# EAGLE design OSO-TIBO-B1-00 (EAGLE 9.6.2)

## Sheet 1 of 2
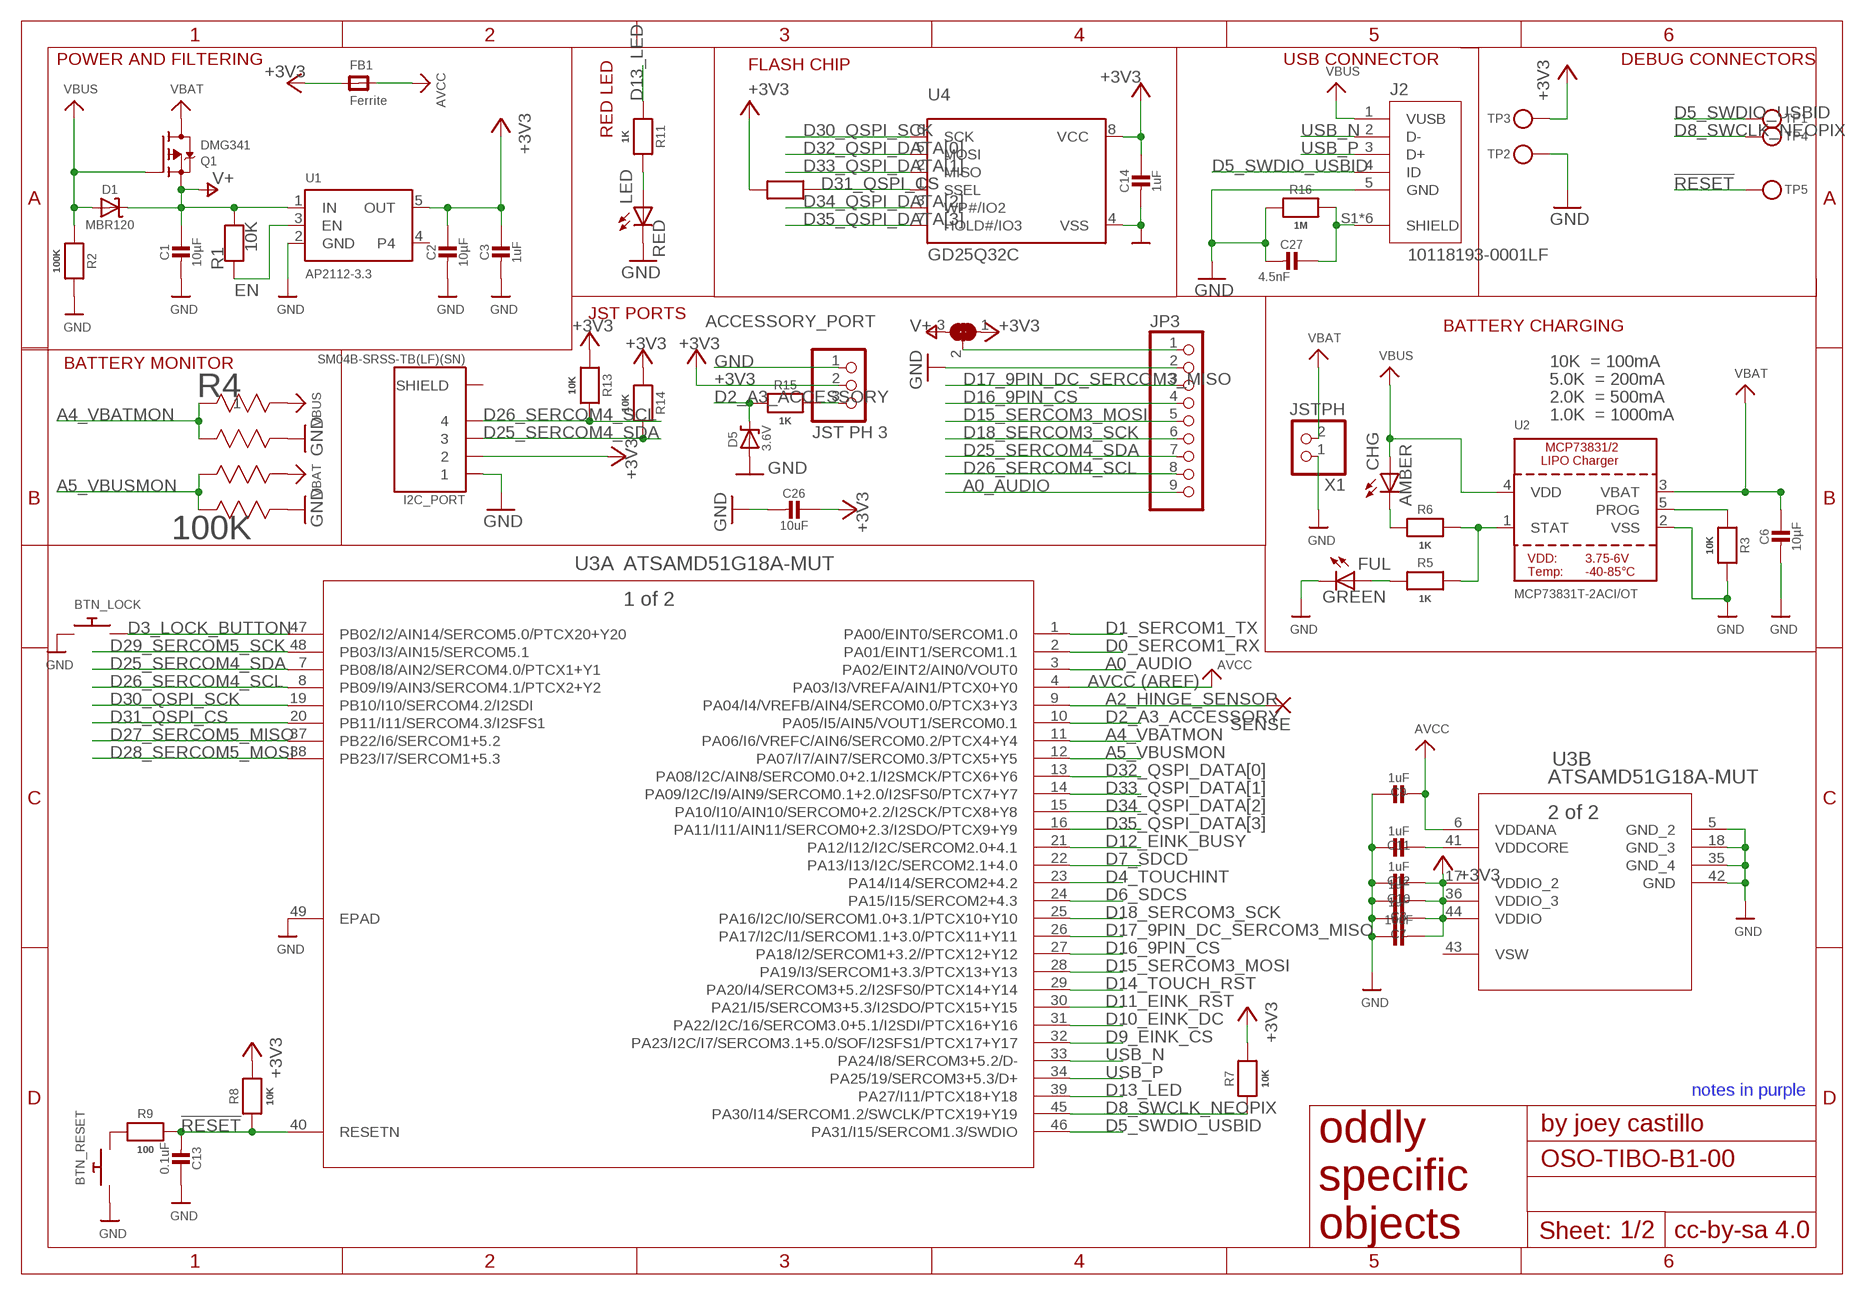
[diagram p0: schematic, sheet 1]

### Parts
ACCESSORY_PORT  JST PH 3  CON_JST_PH_3PIN  [JSTPH3]
BTN_LOCK  SWITCH_PUSHBUTTONC&K_KSS  [BTN_CK_KSS]
BTN_RESET  SWITCH_PUSHBUTTONC&K_KSS  [BTN_CK_KSS]
C1  10µF  CAP_CERAMIC0805-NOOUTLINE  [0805-NO]
C2  10µF  CAP_CERAMIC0805-NOOUTLINE  [0805-NO]
C3  1uF  CAP_CERAMIC0805-NOOUTLINE  [0805-NO]
C6  10µF  CAP_CERAMIC0805-NOOUTLINE  [0805-NO]
C7  10uF  CAP_CERAMIC0805-NOOUTLINE  [0805-NO]
C8  1uF  CAP_CERAMIC0805-NOOUTLINE  [0805-NO]
C9  1uF  CAP_CERAMIC0805-NOOUTLINE  [0805-NO]
C10  1uF  CAP_CERAMIC0805_10MGAP  [0805_10MGAP]
C11  1uF  CAP_CERAMIC0805_10MGAP  [0805_10MGAP]
C12  1uF  CAP_CERAMIC0805_10MGAP  [0805_10MGAP]
C13  0.1uF  CAP_CERAMIC0805_10MGAP  [0805_10MGAP]
C14  1uF  CAP_CERAMIC0805_10MGAP  [0805_10MGAP]
C26  10uF  CAP_CERAMIC0805-NOOUTLINE  [0805-NO]
C27  4.5nF  CAP_CERAMIC0805-NOOUTLINE  [0805-NO]
CHG  AMBER  LEDCHIPLED_0805  [CHIPLED_0805]
D1  MBR120  DIODE-SCHOTTKYSOD-123  [SOD-123]
D5  3.6V  DIODE-ZENERSOD123  [SOD-123]
FB1  Ferrite  FERRITE0805  [0805]
FUL  GREEN  LEDCHIPLED_0805  [CHIPLED_0805]
I2C_PORT  SM04B-SRSS-TB(LF)(SN)  [JST_SM04B-SRSS-TB(LF)(SN)]
J2  10118193-0001LF  [FCI_10118193-0001LF]
JP3  HEADER-1X9_JSTSH  [JST_SH9]
LED  RED  LEDCHIPLED_0805  [CHIPLED_0805]
Q1  DMG341  MOSFET-P  [SOT23-R]
R1  10K  RESISTOR0805_NOOUTLINE  [0805-NO]
R2  100K  RESISTOR0805_NOOUTLINE  [0805-NO]
R3  10K  RESISTOR0805_NOOUTLINE  [0805-NO]
R4  100K  EXB-V8V103JV  [EXBV8V]
R5  1K  RESISTOR0805_NOOUTLINE  [0805-NO]
R6  1K  RESISTOR0805_NOOUTLINE  [0805-NO]
R7  10K  RESISTOR0805_NOOUTLINE  [0805-NO]
R8  10K  RESISTOR0805_NOOUTLINE  [0805-NO]
R9  100  RESISTOR0805_10MGAP  [0805_10MGAP]
R10  10K  RESISTOR0805_NOOUTLINE  [0805-NO]
R11  1K  RESISTOR0805_NOOUTLINE  [0805-NO]
R13  10K  RESISTOR0805_NOOUTLINE  [0805-NO]
R14  10K  RESISTOR0805_NOOUTLINE  [0805-NO]
R15  1K  RESISTOR_0805MP  [_0805MP]
R16  1M  RESISTOR0805_NOOUTLINE  [0805-NO]
SENSE  SMD5  [SMD2,54-5,08]
SJ1  SOLDERJUMPER_2WAY  [SOLDERJUMPER_2WAY_OPEN_NOPASTE]
TP1  TESTPOINTROUND2MMNO  [TESTPOINT_ROUND_2MM_NO]
TP2  TESTPOINTROUND2MMNO  [TESTPOINT_ROUND_2MM_NO]
TP3  TESTPOINTROUND2MMNO  [TESTPOINT_ROUND_2MM_NO]
TP4  TESTPOINTROUND2MMNO  [TESTPOINT_ROUND_2MM_NO]
TP5  TESTPOINTROUND2MMNO  [TESTPOINT_ROUND_2MM_NO]
U1  AP2112-3.3  VREG_SOT23-5  [SOT23-5]
U2  MCP73831T-2ACI/OT  MCP73831/2  [SOT23-5]
U3  ATSAMD51G18A-MUT  [QFN48_7X7MC]
U4  GD25Q32C  MICROBUILDER_SPIFLASH_SOIC8  [MICROBUILDER_SOIC8_150MIL]
X1  JSTPH  CON_JST_PH_2PIN  [JSTPH2]

### Nets
!RESET: C13.2 R8.1 R9.2 TP5.P$1 U3.40(A:RESETN)
+3V3 [power]: ACCESSORY_PORT.2 C2.1 C3.1 C7.2 C8.2 C10.2 C12.2 C14.1 C26.1 FB1.1 I2C_PORT.2 R7.2 R8.2 R10.2 R13.1 R14.1 SJ1.1 TP3.P$1 U1.5(OUT) U3.17(B:VDDIO_2) U3.36(B:VDDIO_3) U3.44(B:VDDIO) U4.8(VCC) ; also sheet 2
_ACCESSORY: ACCESSORY_PORT.3 R15.1
A0_AUDIO: JP3.9 U3.3(A:PA02/EINT2/AIN0/VOUT0)
A2_HINGE_SENSOR: SENSE.1(P) U3.9(A:PA04/I4/VREFB/AIN4/SERCOM0.0/PTCX3+Y3)
A4_VBATMON: R4.1 R4.2 U3.11(A:PA06/I6/VREFC/AIN6/SERCOM0.2/PTCX4+Y4)
A5_VBUSMON: R4.3 R4.4 U3.12(A:PA07/I7/AIN7/SERCOM0.3/PTCX5+Y5)
AVCC: C9.2 FB1.2 U3.4(A:PA03/I3/VREFA/AIN1/PTCX0+Y0) U3.6(B:VDDANA)
D0_SERCOM1_RX: U3.2(A:PA01/EINT1/SERCOM1.1) ; also sheet 2
D1_SERCOM1_TX: U3.1(A:PA00/EINT0/SERCOM1.0) ; also sheet 2
D2_A3_ACCESSORY: D5.C R15.2 U3.10(A:PA05/I5/AIN5/VOUT1/SERCOM0.1)
D3_LOCK_BUTTON: BTN_LOCK.P$2 U3.47(A:PB02/I2/AIN14/SERCOM5.0/PTCX20+Y20)
D4_TOUCHINT: U3.23(A:PA14/I14/SERCOM2+4.2) ; also sheet 2
D5_SWDIO_USBID: J2.4(ID) TP1.P$1 U3.46(A:PA31/I15/SERCOM1.3/SWDIO)
D6_SDCS: U3.24(A:PA15/I15/SERCOM2+4.3) ; also sheet 2
D7_SDCD: U3.22(A:PA13/I13/I2C/SERCOM2.1+4.0) ; also sheet 2
D8_SWCLK_NEOPIX: R7.1 TP4.P$1 U3.45(A:PA30/I14/SERCOM1.2/SWCLK/PTCX19+Y19) ; also sheet 2
D9_EINK_CS: U3.32(A:PA23/I2C/I7/SERCOM3.1+5.0/SOF/I2SFS1/PTCX17+Y17) ; also sheet 2
D10_EINK_DC: U3.31(A:PA22/I2C/16/SERCOM3.0+5.1/I2SDI/PTCX16+Y16) ; also sheet 2
D11_EINK_RST: U3.30(A:PA21/I5/SERCOM3+5.3/I2SDO/PTCX15+Y15) ; also sheet 2
D12_EINK_BUSY: U3.21(A:PA12/I12/I2C/SERCOM2.0+4.1) ; also sheet 2
D13_LED: R11.1 U3.39(A:PA27/I11/PTCX18+Y18)
D14_TOUCH_RST: U3.29(A:PA20/I4/SERCOM3+5.2/I2SFS0/PTCX14+Y14) ; also sheet 2
D15_SERCOM3_MOSI: JP3.5 U3.28(A:PA19/I3/SERCOM1+3.3/PTCX13+Y13) ; also sheet 2
D16_9PIN_CS: JP3.4 U3.27(A:PA18/I2/SERCOM1+3.2//PTCX12+Y12)
D17_9PIN_DC_SERCOM3_MISO: JP3.3 U3.26(A:PA17/I2C/I1/SERCOM1.1+3.0/PTCX11+Y11)
D18_SERCOM3_SCK: JP3.6 U3.25(A:PA16/I2C/I0/SERCOM1.0+3.1/PTCX10+Y10) ; also sheet 2
D25_SERCOM4_SDA: I2C_PORT.3 JP3.7 R14.2 U3.7(A:PB08/I8/AIN2/SERCOM4.0/PTCX1+Y1) ; also sheet 2
D26_SERCOM4_SCL: I2C_PORT.4 JP3.8 R13.2 U3.8(A:PB09/I9/AIN3/SERCOM4.1/PTCX2+Y2) ; also sheet 2
D27_SERCOM5_MISO: U3.37(A:PB22/I6/SERCOM1+5.2) ; also sheet 2
D28_SERCOM5_MOSI: U3.38(A:PB23/I7/SERCOM1+5.3) ; also sheet 2
D29_SERCOM5_SCK: U3.48(A:PB03/I3/AIN15/SERCOM5.1) ; also sheet 2
D30_QSPI_SCK: U3.19(A:PB10/I10/SERCOM4.2/I2SDI) U4.6(SCK)
D31_QSPI_CS: R10.1 U3.20(A:PB11/I11/SERCOM4.3/I2SFS1) U4.1(SSEL)
D32_QSPI_DATA[0]: U3.13(A:PA08/I2C/AIN8/SERCOM0.0+2.1/I2SMCK/PTCX6+Y6) U4.5(MOSI)
D33_QSPI_DATA[1]: U3.14(A:PA09/I2C/I9/AIN9/SERCOM0.1+2.0/I2SFS0/PTCX7+Y7) U4.2(MISO)
D34_QSPI_DATA[2]: U3.15(A:PA10/I10/AIN10/SERCOM0+2.2/I2SCK/PTCX8+Y8) U4.3(WP#/IO2)
D35_QSPI_DATA[3]: U3.16(A:PA11/I11/AIN11/SERCOM0+2.3/I2SDO/PTCX9+Y9) U4.7(HOLD#/IO3)
EN: R1.1 U1.3(EN) ; also sheet 2
GND [gnd]: ACCESSORY_PORT.1 BTN_LOCK.P$1 BTN_RESET.P$1 C1.2 C2.2 C3.2 C6.2 C7.1 C8.1 C9.1 C10.1 C11.1 C12.1 C13.1 C14.2 C26.2 C27.2 D5.A FUL.C I2C_PORT.1 J2.5(GND) JP3.2 LED.C R2.2 R3.2 R4.5 R4.7 R16.2 TP2.P$1 U1.2(GND) U2.2(VSS) U3.5(B:GND_2) U3.18(B:GND_3) U3.35(B:GND_4) U3.42(B:GND) U3.49(A:EPAD) U4.4(VSS) X1.1 ; also sheet 2
N$1: BTN_RESET.P$2 R9.1
N$4: CHG.C R6.1
N$5 [power]: JP3.1 SJ1.2
N$7: LED.A R11.2
N$9: FUL.A R5.1
PROG: R3.1 U2.5(PROG)
SHIELD [gnd]: C27.1 J2.S1(SHIELD) J2.S2(SHIELD) J2.S3(SHIELD) J2.S4(SHIELD) J2.S5(SHIELD) J2.S6(SHIELD) R16.1
STAT: R5.2 R6.2 U2.1(STAT)
USB_N: J2.2(D-) U3.33(A:PA24/I8/SERCOM3+5.2/D-)
USB_P: J2.3(D+) U3.34(A:PA25/19/SERCOM3+5.3/D+)
V+ [power]: C1.1 D1.C Q1.2(S) R1.2 SJ1.3 U1.1(IN)
VBAT [power]: C6.1 Q1.3(D) R4.6 U2.3(VBAT) X1.2
VBUS [power]: CHG.A D1.A J2.1(VUSB) Q1.1(G) R2.1 R4.8 U2.4(VDD)
VDDCORE: C11.2 U3.41(B:VDDCORE)
Unconnected: I2C_PORT.S1(SHIELD) I2C_PORT.S2(SHIELD) U1.4

### Notes on the sheet
- RED LED
- POWER AND FILTERING | USB CONNECTOR | DEBUG CONNECTORS
- FLASH CHIP
- JST PORTS
- BATTERY CHARGING
- BATTERY MONITOR | 10K  = 100mA
- 5.0K  = 200mA
- 2.0K  = 500mA
- 1.0K  = 1000mA
- (AREF)
- notes in purple

## Sheet 2 of 2
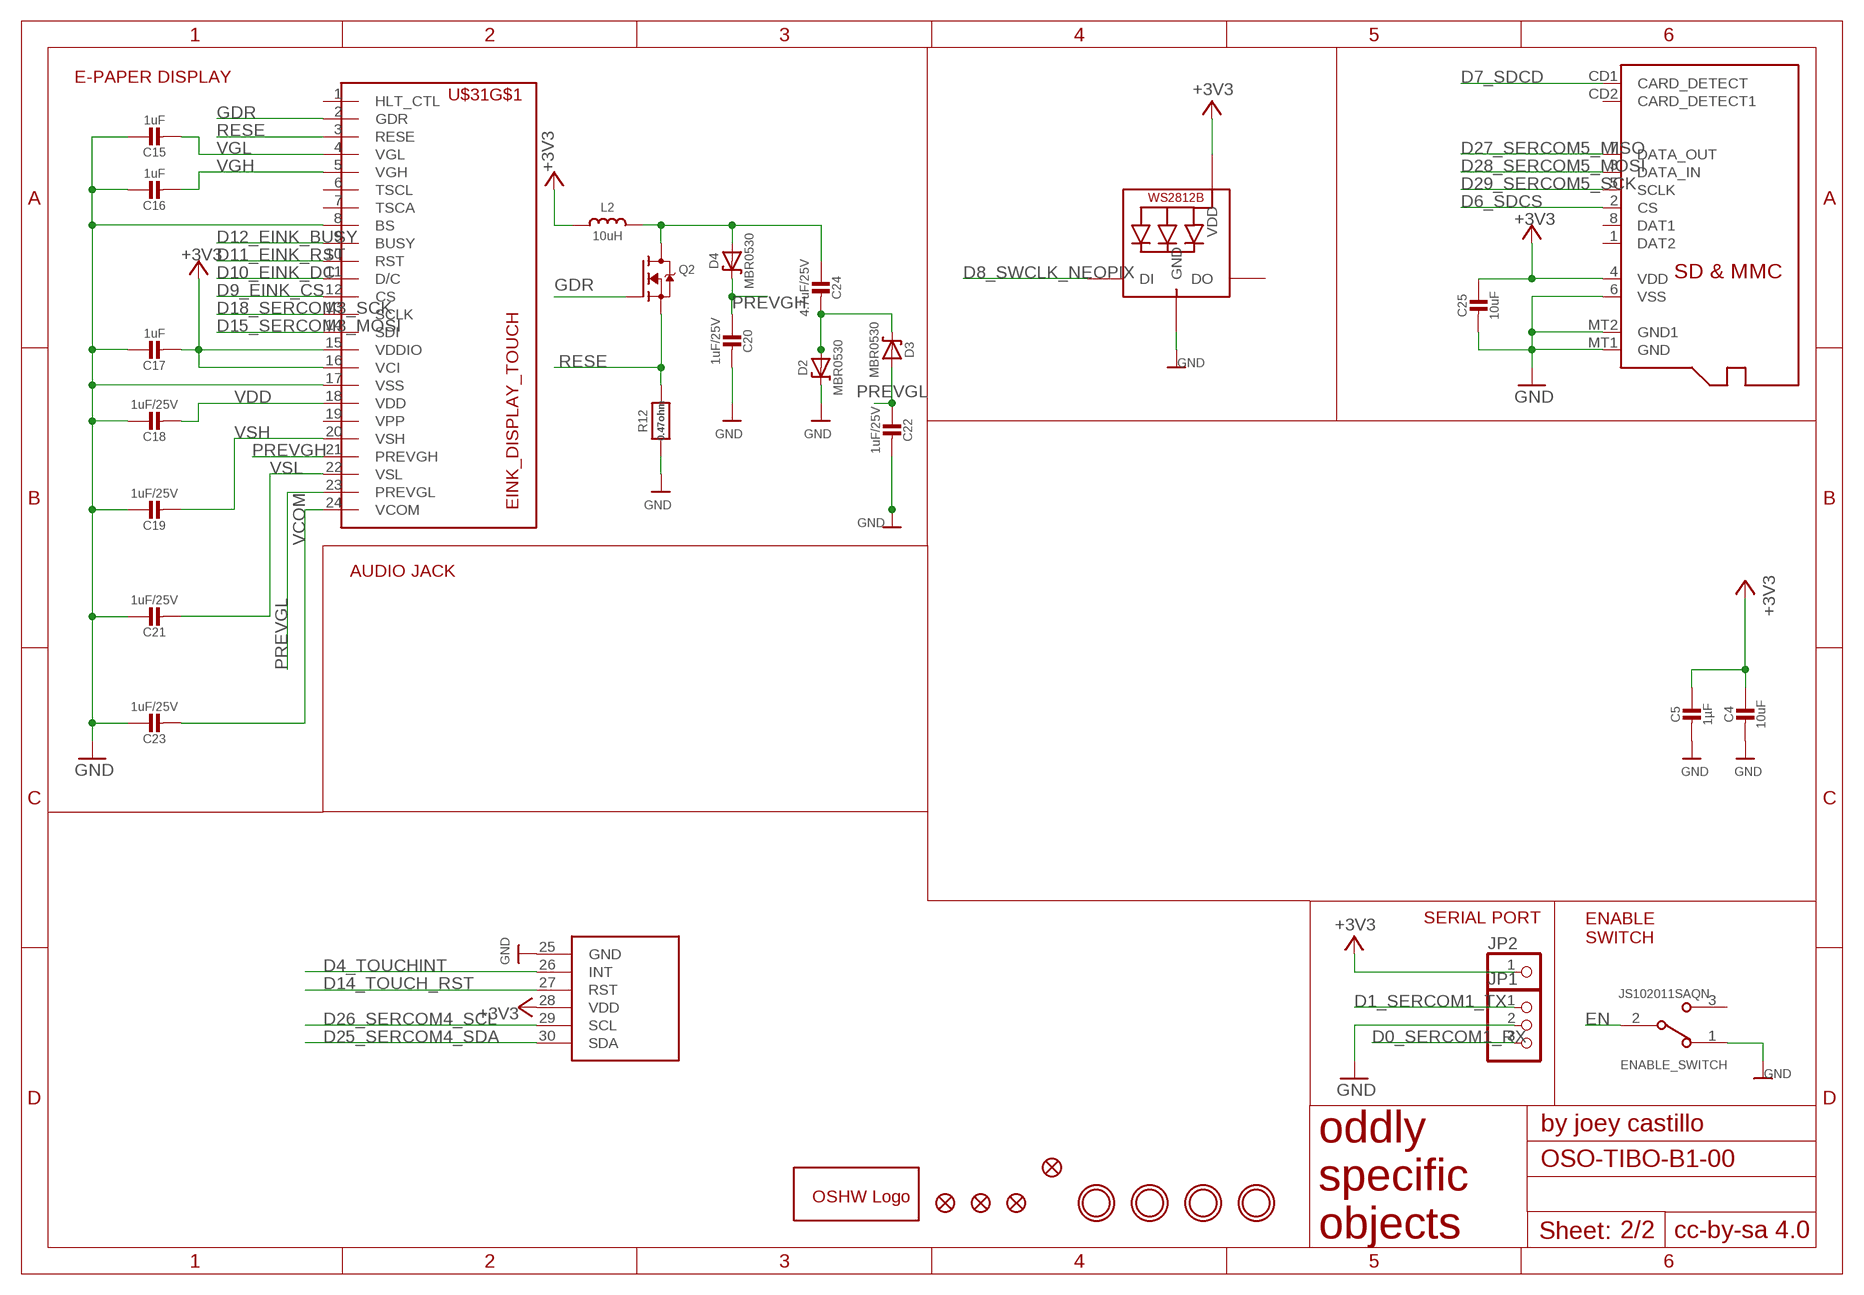
[diagram p1: schematic, sheet 2]

### Parts
C4  10uF  CAP_CERAMIC0805-NOOUTLINE  [0805-NO]
C5  1µF  CAP_CERAMIC0805-NOOUTLINE  [0805-NO]
C15  1uF  CAP_CERAMIC0805_10MGAP  [0805_10MGAP]
C16  1uF  CAP_CERAMIC0805_10MGAP  [0805_10MGAP]
C17  1uF  CAP_CERAMIC0805_10MGAP  [0805_10MGAP]
C18  1uF/25V  CAP_CERAMIC0805_10MGAP  [0805_10MGAP]
C19  1uF/25V  CAP_CERAMIC0805_10MGAP  [0805_10MGAP]
C20  1uF/25V  CAP_CERAMIC0805_10MGAP  [0805_10MGAP]
C21  1uF/25V  CAP_CERAMIC0805_10MGAP  [0805_10MGAP]
C22  1uF/25V  CAP_CERAMIC0805_10MGAP  [0805_10MGAP]
C23  1uF/25V  CAP_CERAMIC0805_10MGAP  [0805_10MGAP]
C24  4.7uF/25V  CAP_CERAMIC0805-NOOUTLINE  [0805-NO]
C25  10uF  CAP_CERAMIC0805_10MGAP  [0805_10MGAP]
D2  MBR0530  DIODE-SCHOTTKYSOD-123  [SOD-123]
D3  MBR0530  DIODE-SCHOTTKYSOD-123  [SOD-123]
D4  MBR0530  DIODE-SCHOTTKYSOD-123  [SOD-123]
ENABLE_SWITCH  JS102011SAQN  [SW_JS102011SAQN]
FID1  FIDUCIAL_1MM  [FIDUCIAL_1MM]
FID2  FIDUCIAL_1MM  [FIDUCIAL_1MM]
FID3  FIDUCIAL_1MM  [FIDUCIAL_1MM]
FID4  FIDUCIAL_1MM  [FIDUCIAL_1MM]
GOLD_ORB_SM1  OSHWLOGOLOGO5MM  [OSHW_5MM]
JP1  PINHD-1X3  [1X03]
JP2  PINHD-1X1  [1X01]
L2  10uH  MICROBUILDER_INDUCTORNR401_BIGPADS  [MICROBUILDER_INDUCTOR_4X4MM_NR401_BIGPADS]
MICROSD  MICROSD  [MICROSD]
NEOPIXEL  WS2812B_4020  [WS2812B_4020]
Q2  IRLML0100  IRLML2060TRPBF  [SOT23-3]
R12  0.47ohm  RESISTOR0805_10MGAP  [0805_10MGAP]
U$1  MOUNTINGHOLE2.5  [MOUNTINGHOLE_2.5_PLATED]
U$4  MOUNTINGHOLE2.5  [MOUNTINGHOLE_2.5_PLATED]
U$5  MOUNTINGHOLE2.5  [MOUNTINGHOLE_2.5_PLATED]
U$7  MOUNTINGHOLE2.5  [MOUNTINGHOLE_2.5_PLATED]
U$31  EINK_DISPLAY_TOUCH  [EINK_DISPLAY_2_7_IN_TOUCH]

### Nets
+3V3 [power]: C4.1 C5.1 C17.2 C25.1 JP2.1 L2.P$1 MICROSD.4(VDD) NEOPIXEL.2(VDD) U$31.15(VDDIO) U$31.16(VCI) U$31.28(VDD) ; also sheet 1
D0_SERCOM1_RX: JP1.3 ; also sheet 1
D1_SERCOM1_TX: JP1.1 ; also sheet 1
D4_TOUCHINT: U$31.26(INT) ; also sheet 1
D6_SDCS: MICROSD.2(CS) ; also sheet 1
D7_SDCD: MICROSD.CD1(CARD_DETECT) ; also sheet 1
D8_SWCLK_NEOPIX: NEOPIXEL.1(DI) ; also sheet 1
D9_EINK_CS: U$31.12(CS) ; also sheet 1
D10_EINK_DC: U$31.11(D/C) ; also sheet 1
D11_EINK_RST: U$31.10(RST) ; also sheet 1
D12_EINK_BUSY: U$31.9(BUSY) ; also sheet 1
D14_TOUCH_RST: U$31.27(RST) ; also sheet 1
D15_SERCOM3_MOSI: U$31.14(SDI) ; also sheet 1
D18_SERCOM3_SCK: U$31.13(SCLK) ; also sheet 1
D25_SERCOM4_SDA: U$31.30(SDA) ; also sheet 1
D26_SERCOM4_SCL: U$31.29(SCL) ; also sheet 1
D27_SERCOM5_MISO: MICROSD.7(DATA_OUT) ; also sheet 1
D28_SERCOM5_MOSI: MICROSD.3(DATA_IN) ; also sheet 1
D29_SERCOM5_SCK: MICROSD.5(SCLK) ; also sheet 1
EN: ENABLE_SWITCH.2 ; also sheet 1
GDR: Q2.1(G) U$31.2(GDR)
GND [gnd]: C4.2 C5.2 C15.1 C16.1 C17.1 C18.1 C19.1 C20.2 C21.1 C22.2 C23.1 C25.2 D2.C ENABLE_SWITCH.1 JP1.2 MICROSD.6(VSS) MICROSD.MT1(GND) MICROSD.MT2(GND1) NEOPIXEL.4(GND) R12.2 U$31.8(BS) U$31.17(VSS) U$31.25(GND) ; also sheet 1
N$2: C24.2 D2.A D3.C
N$3: C24.1 D4.A L2.P$2 Q2.3(D)
PREVGH: C20.1 D4.C U$31.21(PREVGH)
PREVGL: C22.1 D3.A U$31.23(PREVGL)
RESE: Q2.2(S) R12.1 U$31.3(RESE)
VCOM: C23.2 U$31.24(VCOM)
VDD: C18.2 U$31.18(VDD)
VGH: C16.2 U$31.5(VGH)
VGL: C15.2 U$31.4(VGL)
VSH: C19.2 U$31.20(VSH)
VSL: C21.2 U$31.22(VSL)
Unconnected: ENABLE_SWITCH.3 MICROSD.1(DAT2) MICROSD.8(DAT1) MICROSD.CD2(CARD_DETECT1) NEOPIXEL.3(DO) U$31.1(HLT_CTL) U$31.6(TSCL) U$31.7(TSCA) U$31.19(VPP)

### Notes on the sheet
- E-PAPER DISPLAY
- AUDIO JACK
- SERIAL PORT
- ENABLE
  SWITCH

## Power pins joined to a net without a drawn wire
VSW: U3.43(B:VSW)

## Library data of the parts
ACCESSORY_PORT = microbuilder:CON_JST_PH_3PIN
BTN_LOCK BTN_RESET = adafruit:SWITCH_PUSHBUTTON: Buttons SOFTTOUCHSMD_SJ - Soft touch temporary push button (Super Junk Akihabara) Compatible with SKPMANE010 [Mouser: 688-SKPMAN] C&K_KSS = Digikey: KSS221GLFS
C1-C27 = microbuilder:CAP_CERAMIC: Ceramic Capacitors For new designs, use the packages preceded by an '_' character since they are more reliable: The following footprints should be used on most boards: _0402 - Standard footprint for regular board layouts _0603 - Standard footprint for regular board layouts _0805 - Standard footprint for regular board layouts _1206 - Standard footprint for regular board layouts For extremely tight-pitch boards where space is at a premium, the following 'micro-pitch' footprints can be used (smaller pads, no silkscreen outline, etc.): _0402MP - Micro-pitch footprint for very dense/compact boards _0603MP - Micro-pitch footprint for very dense/compact boards _0805MP - Micro-pitch footprint for very dense/compact boards _1206MP - Micro-pitch footprint for very dense/compact boards
CHG FUL LED = adafruit:LED: LED OSRAM: - CHIPLED LG R971, LG N971, LY N971, LG Q971, LY Q971, LO R971, LY R971 LH N974, LH R974 LS Q976, LO Q976, LY Q976 LO Q996 - Hyper CHIPLED LW Q18S LB Q993, LB Q99A, LB R99A - SideLED LS A670, LO A670, LY A670, LG A670, LP A670 LB A673, LV A673, LT A673, LW A673 LH A674 LY A675 LS A676, LA A676, LO A676, LY A676, LW A676 LS A679, LY A679, LG A679 - Hyper Micro SIDELED® LS Y876, LA Y876, LO Y876, LY Y876 LT Y87S - SmartLED LW L88C, LW L88S LB L89C, LB L89S, LG L890 LS L89K, LO L89K, LY L89K LS L896, LA L896, LO L896, LY L896 - TOPLED LS T670, LO T670, LY T670, LG T670, LP T670 LSG T670, LSP T670, LSY T670, LOP T670, LYG T670 LG T671, LOG T671, LSG T671 LB T673, LV T673, LT T673, LW T673 LH T674 LS T676, LA T676, LO T676, LY T676, LB T676, LH T676, LSB T676, LW T676 LB T67C, LV T67C, LT T67C, LS T67K, LO T67K, LY T67K, LW E67C LS E67B, LA E67B, LO E67B, LY E67B, LB E67C, LV E67C, LT E67C LW T67C LS T679, LY T679, LG T679 LS T770, LO T770, LY T770, LG T770, LP T770 LB T773, LV T773, LT T773, LW T773 LH T774 LS E675, LA E675, LY E675, LS T675 LS T776, LA T776, LO T776, LY T776, LB T776 LHGB T686 LT T68C, LB T68C - Hyper Mini TOPLED® LB M676 - Mini TOPLED Santana® LG M470 LS M47K, LO M47K, LY M47K Source: http://www.osram.convergy.de/
D1-D4 = microbuilder:DIODE-SCHOTTKY
D5 = microbuilder:DIODE-ZENER: Zener Diode SMA: 30V 1W Zener Diode, 1.2Vf - Digikey: SMAZ30-FDICT-ND
ENABLE_SWITCH = JS102011SAQN:JS102011SAQN: JS10 Series SPDT On-On 6 V 0.3 A Gull Wing SMT Slide Switch http://www.snapeda.com/parts/JS102011SAQN/C%26K%20Components/view-part/; DESCRIPTION: Slide Switch SPDT Surface Mount, Right Angle; DIGI-KEY_PART_NUMBER: 401-1999-1-ND; DIGI-KEY_PURCHASE_URL: https://www.digikey.com/product-detail/en/c-k/JS102011SAQN/401-1999-1-ND/1640114?utm_source=snapeda&utm_medium=aggregator&utm_campaign=symbol; MF: C&K; MP: JS102011SAQN; PACKAGE: None
FB1 = microbuilder:FERRITE: Ferrite Bead 0603 MMZ1608B121C - 120 Ohm @ 100MHz, 600mA, 0.15 Ohm DC Resistance - Digikey: 445-2164-1-ND BK1608HW121-T - 120 Ohm, 600mA Ferrite Chip - Digikey: 587-1876-2-ND 0805 HZ0805B272R-10 - 2.7K Ohm @ 100MHz, 200mA, 0.8 Ohm DC Resistance - Digikey: 240-2504-1-ND (see also Murata BLM21BD272SN1L) MMZ2012Y152B - 1.5K Ohm @ 100MHz, 500mA, 0.4 Ohm DC Resistance - Digikey: 445-1560-1-ND - Mainly for high frequency (80-400MHz) MMZ2012R102A - 1K Ohm @ 100MHz, 500mA, 0.3 Ohm DC Resistance - Digikey: 445-1555-2-ND - More general purpose (10-200MHz)
FID1-FID4 = microbuilder:FIDUCIAL: Fiducial Alignment Points Various fiducial points for machine vision alignment.; BOM: EXCLUDE
GOLD_ORB_SM1 = oshw:OSHWLOGO: The OSHW logo for PCB layout
I2C_PORT = SM04B-SRSS-TB_LF__SN_:SM04B-SRSS-TB(LF)(SN): SH Series 1.0 mm Pitch 2 Position Single Row Side Entry Shrouded Header; DESCRIPTION: SH Series 1.0 mm Pitch 2 Position Single Row Side Entry Shrouded Header; DIGI-KEY_PART_NUMBER: 455-1804-1-ND; DIGI-KEY_PURCHASE_URL: https://www.digikey.com/product-detail/en/jst-sales-america-inc/SM04B-SRSS-TB_LF__SN_/455-1804-1-ND/926875?utm_source=snapeda&utm_medium=aggregator&utm_campaign=symbol; MF: JST Sales; MP: SM04B-SRSS-TB_LF__SN_; PACKAGE: None
J2 = 10118193-0001LF:10118193-0001LF: Micro USB B Type Receptacle; DESCRIPTION: Single Port 5 Contact Shielded SMT MICRO USB B-Type Receptacle; DIGI-KEY_PART_NUMBER: 609-4616-1-ND; DIGI-KEY_PURCHASE_URL: https://www.digikey.com/product-detail/en/amphenol-icc-fci/10118193-0001LF/609-4616-1-ND/2785380?utm_source=snapeda&utm_medium=aggregator&utm_campaign=symbol; MF: Amphenol ICC; MP: 10118193-0001LF; PACKAGE: None
JP1 = adafruit:PINHD-1X3: PIN HEADER
JP2 = adafruit:PINHD-1X1: Pin header 1x1 for 0.1" spacing With round pins
JP3 = My Stuff:HEADER-1X9: PIN HEADER
L2 = Adafruit 3.5in 480x320 FeatherWing:MICROBUILDER_INDUCTOR: Inductors 0603: 10nH Ceramic Inductor - microwire antenna/RF (Digikey: 712-1434-2-ND) 0805: 560nH Ceramic Inductor - RF (Digikey: 553-1047-1-ND) 270nH Ceramic Inductor - Q = 40@250MHz, +-5%, 1 Ohm DC Resistance (Digikey: 535-10506-2-ND) 1007 (2518 Metric) SMT: 10µH 10% 250mOhm 820mA 1007 Inductor (Digikey: 587-2189-1-ND) 22µH 10% 500mOhm 580mA 1007 Inductor (Digikey: 587-2190-1-ND) 47µH 10% 950mOhm 420mA 1007 Inductor (Digikey: 587-2191-1-ND) 47µH 5% 100mOhm 1A 1008 Inductor (Digikey: 732-1816-1-ND) 5.0x5.0mm (Taiyo Yuden NR5040 Series) 6.8µH 20% 2.3A 64mOhm Inductor (Digikey: 587-2374-2-ND) 5.0x5.0mm (TDK VLC5045 Series) 4.7µH 20% 3.3A 34mOhm Inductor (Digikey: 445-6526-1-ND) 6.8µH 20% 2.7A 46mOhm Inductor (Digikey: 445-6527-1-ND) 6.0x6.0mm (TDK VLC6045 Series) 4.7µH 20% 3.8A 27mOhm Inductor (Digikey: 445-6538-2-ND) 6.8µH 20% 3A 41mOhm Inductor (Digikey: 445-6540-1-ND) 6.2µH 30% 2.2A 45mOhm Inductor (Digikey: SRR5028-6R2YCT-ND) - Not TDK VLC6045 but footprint should match 6.0x6.0mm (TDK SLF6045 Series) 6.8uH 30% 2A 33mOhm Inductor (Digikey: 445-4572-1-ND, Mouser: 810-SLF645T6R8N2R0PF) 6.0x6.0mm (Sumida CDRH5D28 Series) 6.2uH 30% 1.8A 45mOhm Inductor (Digikey: 308-1542-1-ND) Taiyo Yuden NR3015T2R2M - 2.2uH 20% 1.5A (Digikey: 587-1648-2-ND, Mouser: 963-NR3015T2R2M) - Used with TI TPS62172 CoilCraft RFID Transponder Coil - MA5532-AE (For use with AS3935 Lightning Sensor) Taiyo Yuden NRH2412T2R2MNGH - 2.2uH 20% 1AA (Digikey: 587-3443-1-ND) - Used with TI LM3671 Vishay IHLP 1.0uH Molded Inductor - 24mOhm DCR, 5A, +/-20%, -55°C-125°C (Digikey: 541-1319-1-ND)
MICROSD = adafruit:MICROSD: Micro-SD / Transflash card holder with SPI pinout For the 3M # 2908-05WB-MG and/or 4UCON #19656 push-push type
NEOPIXEL = microbuilder:WS2812B
Q1 = microbuilder:MOSFET-P: P-Channel Mosfet LEGEND VDS: Voltage Drain-Source ID: Drain Current RDS(ON): Drain-Source On-State Resistance VGS(TH): Gate-Source Threshold Voltage CISS: Drain-Source Input Capacitance SOT-23 Name VDS ID RDS(ON) VGS(TH) CISS Order Number IRLML5103 30V 760mA 600 mOhm -- 75pF @ 25V Digikey: IRLML5103PBFCT-ND IRLML6401 12V 4.3A 50 mOhm 950mV @ 250µA 830pF @ 10V Digikey: IRLML6401PBFTR-ND NTR0202PL 20V 400mA 800 mOhm 2.3V @ 250uA 70pF @ 5V Digikey: NTR0202PLT1GOSTR-ND NTR4101PT1G 20V 1.8A 85 mOhm 1.2V @ 250uA 675pF @ 10V Digikey: NTR4101PT1GOSCT-ND DMP2004K 20V 600mA 900 mOhm 1V @ 250uA 175pF @ 16V Digikey: DMP2004KDICT-ND PMV65XP 20V 3.9A 76 mOhm 950mV @ 1mA 725pF @ 20V Digikey: 568-2358-2-ND TO-252 Name VDS ID RDS(ON) VGS(TH) CISS Order Number AOD417 30V 25A 34 mOhm 3V @ 250µA 920pF @ 15V Digikey: 785-1106-2-ND PowerPak Name VDS ID RDS(ON) VGS(TH) CISS Order Number AON7401 30V 12A 14 mOhm 3V @ 250µA 2600pF @ 15V Digikey: 785-1302-1-ND
Q2 = Parts:IRLML2060TRPBF
R1-R3 R5-R16 = microbuilder:RESISTOR: Resistors For new designs, use the packages preceded by an '_' character since they are more reliable: The following footprints should be used on most boards: _0402 - Standard footprint for regular board layouts _0603 - Standard footprint for regular board layouts _0805 - Standard footprint for regular board layouts _1206 - Standard footprint for regular board layouts For extremely tight-pitch boards where space is at a premium, the following 'micro-pitch' footprints can be used (smaller pads, no silkscreen outline, etc.): _0402MP - Micro-pitch footprint for very dense/compact boards _0603MP - Micro-pitch footprint for very dense/compact boards _0805MP - Micro-pitch footprint for very dense/compact boards _1206MP - Micro-pitch footprint for very dense/compact boards
R4 = resistor array:EXB-V8V103JV; MANUFACTURER_PART_NUMBER: EXBV8V103JV; VENDOR: Panasonic
SENSE = wirepad-mine:SMD5: SMD PAD
SJ1 = Adafruit MONSTER M4SK:SOLDERJUMPER_2WAY: 2-Way Solder Jumper
TP1-TP5 = microbuilder:TESTPOINT: Test Point Various test points for characterisation and PCB testing TESTPOINT_SMT - Compact Surface Mount Test Point [Digikey: 5016KTR-ND]
U1 = microbuilder:VREG_SOT23-5: SOT23-5 Fixed Voltage Regulators Part Current Out V Out V In V Dropout θJA (°C/W) TJ (°C) Digikey Part No. ADP121 150mA 3.3V 3.4-5.5V 0.09V @ 150mA -- -- ADP121-AUJZ33R7CT-ND ADP121 150mA 3.0V 3.1-5.5V 0.09V @ 150mA -- -- ADP121-AUJZ30R7CT-ND ADP122 300mA 3.3V 3.4-5.5V 0.085V @ 300mA -- -- ADP122AUJZ-3.3-R7CT-ND ADP1712 300mA 3.3V 3.5-5.5V 0.17V @ 300mA -- -- ADP1712AUJZ-3.3-R7TR-ND AP7311 (Low Cost) 150mA 3.3V 3.5-6V 0.15V @ 150mA -- -- AP7311-33WG-7DICT-ND LD39015M18R 150mA 1.8V 1.9V-5.5V 0.08V @ 100mA -- -- 497-6977-1-ND LP2985A-33DBVR 150mA 3.3V 3.3-16V 0.28V @ 150mA 206 150 296-18479-1-ND MCP1824T-3302E/OT 300mA 3.3V 3.5V-6V 0.2V @ 300mA -- -- MCP1824T-3302E/OTCT-ND MIC5205-2.5YM5 TR 150mA 2.5V 2.7-16V 0.165V @ 150mA -- -- 576-1257-2-ND MIC5205-3.0YM5 TR 150mA 3.0V 3.2V-16V 0.165V @ 150mA -- -- 576-1258-2-ND MIC5205-3.3YM5 TR 150mA 3.3V 3.5V-16V 0.165V @ 150mA -- -- 576-1259-2-ND TPS780330220 150mA 3.3V+2.2V 3.6-5.5V 250mV Max -- -- 296-23332-1-ND TDA3663/N1,135 100mA 3.3V 3.5-45V 0.18V @ 50mA -- -- 568-5343-1-ND Max operating temp can be calculated using θJA, TJ (max junction temperature), and power in watts. Set the "Maximum Ambient Temperature" until it reaches TJ ("Max Junction Temperature"), which is the absolute limit for safe use of the regulator: Heat Sink Temperature Calculator <http://www.daycounter.com/Calculators/Heat-Sink-Temperature-Calculator.phtml> For example, With 12V source into a 3.3V LP2985 and a 30mA load, we are dissipating (12V-3.3V) * 0.03A = 0.261W. With a θJA of 206 °C/W, a TJ of 150°C, and 261mW we can safely use the chip without a heat sink up to 75°C (=147.1°C Junction Temperature).
U2 = microbuilder:MCP73831/2: MCP73831/2 LIPO Charger VDD: 3.75 - 6V Temp -40 - 85°C Programmable Charge Rate: 15-500mA NOTE: STAT is a tri-state logic output on the MCP73831 and an open-drain output on the MCP73832. SOT23-5 with 4.2V output and tri-state logic on STAT = MCP73831T-2ACI/OT
U3 = ATSAMD51G18AMUT:ATSAMD51G18A-MUT; BUILT_BY: EMA_Molly; COPYRIGHT: Copyright (C) 2018 Accelerated Designs. All rights reserved; MANUFACTURER_PART_NUMBER: ATSAMD51G18A-MUT; VENDOR: Microchip
U4 = Adafruit Feather M0 Express:MICROBUILDER_SPIFLASH_SOIC8: SOIC8 SPI Flash Be careful with the size since SOIC8 flash comes in several 'widths' SOIC8 150 mil M25P16 - 16Mbit (2Mbit x 8) Serial Flash (75MHz SPI Bus), Supply: 2.7-3.6V Digikey: SOIC8 - M25P16-VMN6P-ND SOIC8 208 mil W25Q16BVSSIG - 16Mbit (2Mbit x 8) Serial Flash (104MHz SPI Bus), Supply: 2.7-3.6V Digikey: SOIC8 - W25Q16BVSSIG-ND
U$1 U$4 U$5 U$7 = microbuilder:MOUNTINGHOLE: Mounting Hole For #2 screws (0.086"/2.18mm width, 0.094"/2.4mm hole) use 2.5mm; BOM: EXCLUDE
U$31 = My Stuff:EINK_DISPLAY_TOUCH
X1 = microbuilder:CON_JST_PH_2PIN: JST 2-Pin Right-Angle Connector PH-Series - 4UConnector: 17311 SH-Series - 4UConnector: 07278

## Net classes
0 default: width 0.152 mm, drill 0.254 mm
1 power: width 0.305 mm, drill 0.305 mm
2 gnd: width 0.254 mm, drill 0.254 mm

## Board
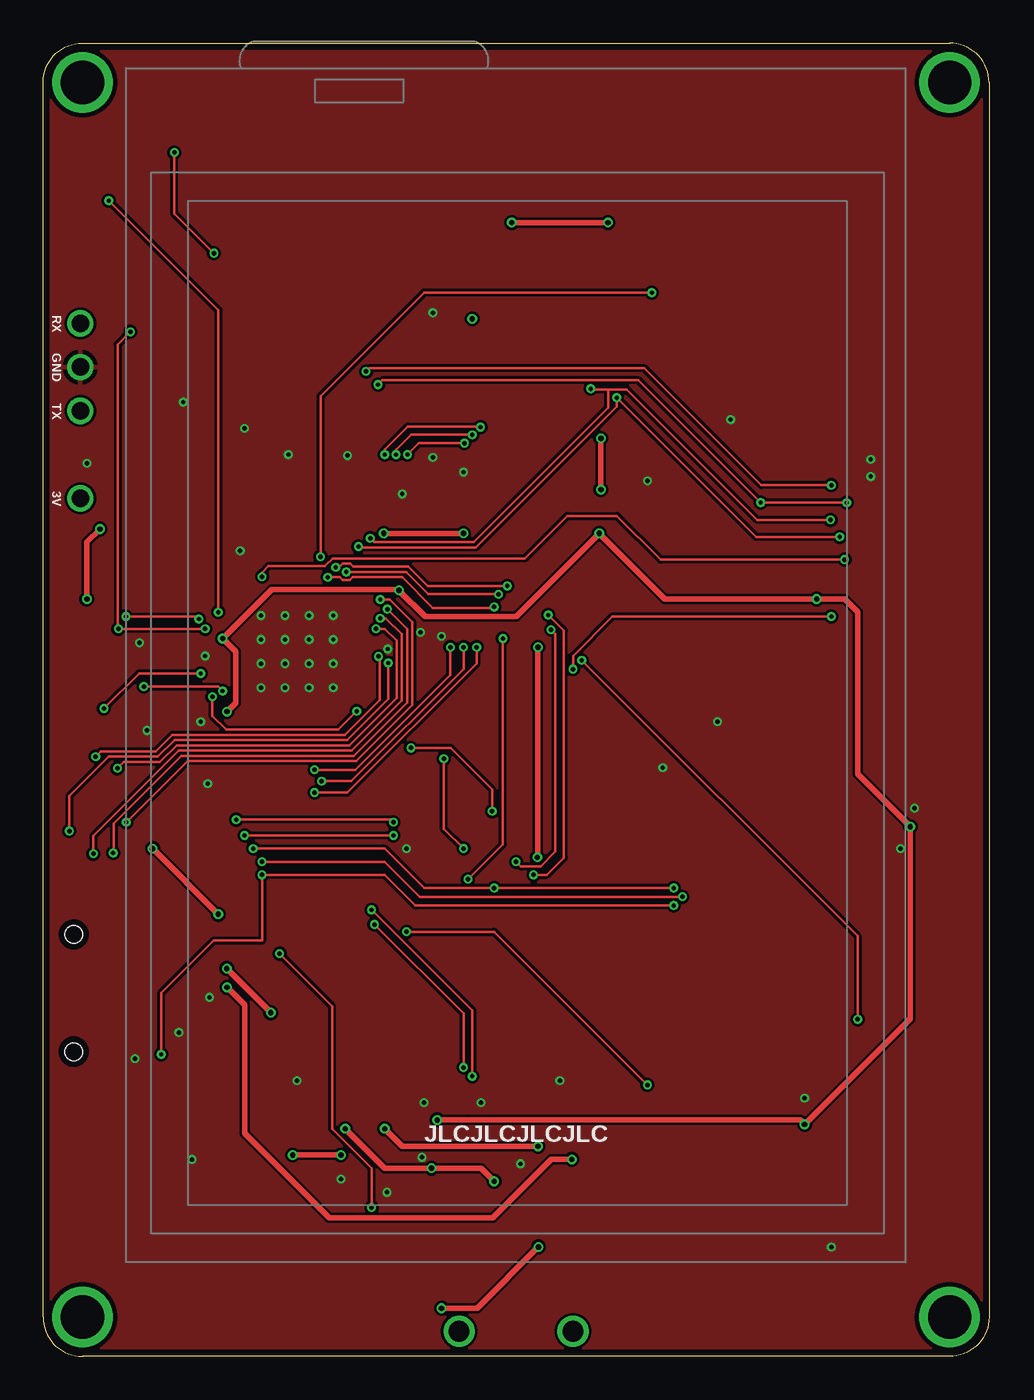
[diagram p2: board, top side]
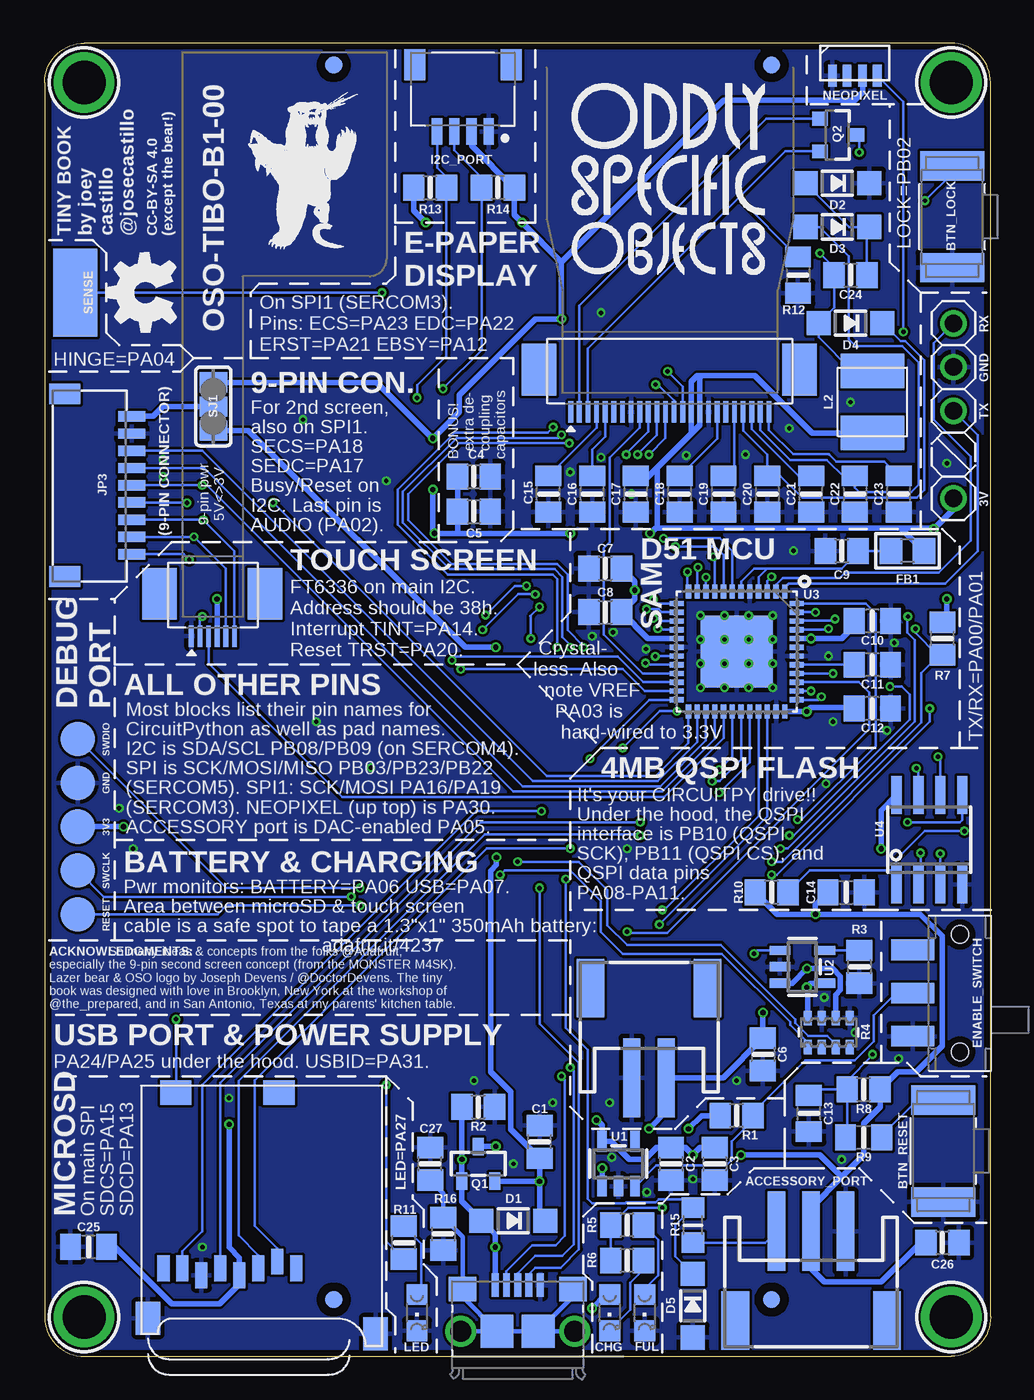
[diagram p3: board, bottom side, seen from below]

Size 54.86 x 76.2 mm. Coordinates in mm from the lower left corner, seen from the top.
Outline: 54.86,73.91 54.86,2.29 arc-90 52.58,0 2.29,0 arc-90 0,2.29 0,73.91 arc-90 2.29,76.2 52.58,76.2 arc-90 54.86,73.91
Copper layers (1*16): Top 0.035559375mm / dielectric 1.6mm / Bottom 0.035559375mm
Design rules "oshpark-2layer *": minimum track width 6mil, minimum drill 10mil, track to track 6mil, track to pad 6mil, pad to pad 6mil, via to via 6mil, smd to smd 6mil, copper to edge 15mil, drill to drill 6mil, minimum pad ring 5mil, minimum via ring 5mil, stop-mask expansion 2.5mil, vias tented up to drill 12mil, thermal gap 10mil
bKeepout: area 24.6,16.3 to 54.6,29; area 24.6,29 to 54.6,41.7

### Footprints (pad centres in the part's own frame; a part is rotated, then mirrored left to right if it is on the bottom)
JSTPH3 = smd 1 x 4.6: 1 -2,-2.7; 2 0,-2.7; 3 2,-2.7 | smd 1.6 x 3.4: NC1 -4.4,2.5; NC2 4.4,2.5
BTN_CK_KSS = smd 1.7 x 3.7: P$1 -2.95,0; P$2 2.95,0
0805-NO = smd 1.24 x 1.5: 1 -0.95,0; 2 0.95,0
0805_10MGAP = smd 1.2 x 1.5: 1 -1.05,0; 2 1.05,0
CHIPLED_0805 = smd 1.2 x 1.2: A 0,-1.05; C 0,1.05
SOD-123 = smd 1.4 x 1.4: A 1.85,0; C -1.85,0
SW_JS102011SAQN = smd 1.2 x 2.5: 1 -2.5,2.75; 2 0,2.75; 3 2.5,2.75 | hole 1: -3.4,0; 3.4,0
0805 = smd 1.3 x 1.5: 1 -0.95,0; 2 0.95,0
FIDUCIAL_1MM = smd 1 x 1: 1 0,0
JST_SM04B-SRSS-TB(LF)(SN) = smd 0.6 x 1.55: 1 -1.5,0; 2 -0.5,0; 3 0.5,0; 4 1.5,0 | smd 1.2 x 1.8: S1 -2.8,-3.875; S2 2.8,-3.875
FCI_10118193-0001LF = smd 0.4 x 1.35: 1 -1.3,2.675; 2 -0.65,2.675; 3 0,2.675; 4 0.65,2.675; 5 1.3,2.675 | smd 1.6 x 1.4: S1 -3.2,2.45; S2 3.2,2.45 | smd 1.9 x 1.9: S3 1.2,0; S4 -1.2,0 | drill 1.2: S5 3.302,0; S6 -3.302,0
1X03 = drill 1.016: 1 -2.54,0; 2 0,0; 3 2.54,0
1X01 = drill 1.016: 1 0,0
JST_SH9 = smd 0.6 x 1.55: 1 -4,2.514; 2 -3,2.514; 3 -2,2.514; 4 -1,2.514; 5 0,2.514; 6 1,2.514; 7 2,2.514; 8 3,2.514; 9 4,2.514 | smd 1.2 x 1.8: MT1 -5.3,-1.386; MT2 5.3,-1.386
MICROBUILDER_INDUCTOR_4X4MM_NR401_BIGPADS = smd 2 x 3.7: P$1 -1.8,0; P$2 1.8,0
MICROSD = smd 0.7 x 1.5: 1 9,-10.64; 2 7.9,-10.24; 3 6.8,-10.64; 4 5.7,-11.04; 5 4.6,-10.64; 6 3.5,-11.04; 7 2.4,-10.64; 8 1.3,-10.64 | smd 1.8 x 1.4: CD1 2,-0.44; CD2 8,-0.44 | smd 1.4 x 1.9: MT1 0.4,-13.54; MT2 13.6,-14.44
WS2812B_4020 = smd 0.5 x 1.25: 1 1.3,-0.75; 2 0.45,-0.75; 3 -0.45,-0.75; 4 -1.3,-0.75
SOT23-R = smd 0.635 x 1.016: 1 -0.95,-1; 2 0.95,-1; 3 0,1
SOT23-3 = smd 0.8 x 0.9: 1 -0.95,-1; 2 0.95,-1; 3 0,1.1
EXBV8V = smd 0.838 x 0.457: 1 -0.838,1.219; 2 -0.838,0.406; 3 -0.838,-0.406; 4 -0.838,-1.219; 5 0.838,-1.219; 6 0.838,-0.406; 7 0.838,0.406; 8 0.838,1.219
_0805MP = smd 1.2 x 1.3: 1 -1.016,0; 2 1.016,0
SMD2,54-5,08 = smd 2.54 x 5.08: 1 0,0
SOLDERJUMPER_2WAY_OPEN_NOPASTE = smd 1.168 x 1.6: 1 -1.397,0; 2 0,0; 3 1.397,0
TESTPOINT_ROUND_2MM_NO = smd 2 x 2: P$1 0,0
SOT23-5 = smd 0.55 x 1.2: 1 -0.95,-1.3; 2 0,-1.3; 3 0.95,-1.3; 4 0.95,1.3; 5 -0.95,1.3
QFN48_7X7MC = smd 0.813 x 0.305: 1 -3.48,2.794; 2 -3.48,2.286; 3 -3.48,1.778; 4 -3.48,1.27; 5 -3.48,0.762; 6 -3.48,0.254; 7 -3.48,-0.254; 8 -3.48,-0.762; 9 -3.48,-1.27; 10 -3.48,-1.778; 11 -3.48,-2.286; 12 -3.48,-2.794; 25 3.48,-2.794; 26 3.48,-2.286; 27 3.48,-1.778; 28 3.48,-1.27; 29 3.48,-0.762; 30 3.48,-0.254; 31 3.48,0.254; 32 3.48,0.762; 33 3.48,1.27; 34 3.48,1.778; 35 3.48,2.286; 36 3.48,2.794 | smd 0.305 x 0.813: 13 -2.794,-3.48; 14 -2.286,-3.48; 15 -1.778,-3.48; 16 -1.27,-3.48; 17 -0.762,-3.48; 18 -0.254,-3.48; 19 0.254,-3.48; 20 0.762,-3.48; 21 1.27,-3.48; 22 1.778,-3.48; 23 2.286,-3.48; 24 2.794,-3.48; 37 2.794,3.48; 38 2.286,3.48; 39 1.778,3.48; 40 1.27,3.48; 41 0.762,3.48; 42 0.254,3.48; 43 -0.254,3.48; 44 -0.762,3.48; 45 -1.27,3.48; 46 -1.778,3.48; 47 -2.286,3.48; 48 -2.794,3.48 | smd 4.191 x 4.191: 49 0,0
MICROBUILDER_SOIC8_150MIL = smd 0.6 x 2.2: 1 -1.905,-2.6; 2 -0.635,-2.6; 3 0.635,-2.6; 4 1.905,-2.6; 5 1.905,2.6; 6 0.635,2.6; 7 -0.635,2.6; 8 -1.905,2.6
MOUNTINGHOLE_2.5_PLATED = drill 2.5 pad 3.2: P$1 0,0
EINK_DISPLAY_2_7_IN_TOUCH = smd 1.25 x 0.275 bottom: 1 19.88,-25.679; 2 19.88,-26.179; 3 19.88,-26.679; 4 19.88,-27.179; 5 19.88,-27.679; 6 19.88,-28.179; 7 19.88,-28.679; 8 19.88,-29.179; 9 19.88,-29.679; 10 19.88,-30.179; 11 19.88,-30.679; 12 19.88,-31.179; 13 19.88,-31.679; 14 19.88,-32.179; 15 19.88,-32.679; 16 19.88,-33.179; 17 19.88,-33.679; 18 19.88,-34.179; 19 19.88,-34.679; 20 19.88,-35.179; 21 19.88,-35.679; 22 19.88,-36.179; 23 19.88,-36.679; 24 19.88,-37.179; 25 32.88,-3.679; 26 32.88,-4.179; 27 32.88,-4.679; 28 32.88,-5.179; 29 32.88,-5.679; 30 32.88,-6.179 | smd 3 x 2 bottom: SPRT1 17.42,-23.829; SPRT2 17.42,-38.939; SPRT3 30.42,-1.829; SPRT4 30.42,-7.939
JSTPH2 = smd 1 x 4.6: 1 -1,-3.7; 2 1,-3.7 | smd 1.6 x 3.4: NC1 -3.4,1.5; NC2 3.4,1.5

### Placement (x,y rotation side)
ACCESSORY_PORT  10.41,4.57 180 bottom
BTN_LOCK  2.24,66.12 90 bottom
BTN_RESET  2.74,11.91 90 bottom
C1  26.16,12.45 90 bottom
C2  18.54,11.18 270 bottom
C3  16,11.18 270 bottom
C4  29.97,51.05 0 bottom
C5  29.97,49.02 0 bottom
C6  13.21,17.53 270 bottom
C7  22.35,45.72 0 bottom
C8  22.35,43.18 0 bottom
C9  8.64,46.74 0 bottom
C10  6.86,42.67 180 bottom
C11  6.86,40.13 180 bottom
C12  6.86,37.59 180 bottom
C13  10.54,14.1 90 bottom
C14  8.38,26.92 0 bottom
C15  25.65,50.04 90 bottom
C16  23.11,50.04 90 bottom
C17  20.57,50.04 90 bottom
C18  18.03,50.04 90 bottom
C19  15.49,50.04 90 bottom
C20  12.95,50.04 270 bottom
C21  10.41,50.04 90 bottom
C22  7.87,50.04 270 bottom
C23  5.33,50.04 90 bottom
C24  8.13,62.74 0 bottom
C25  52.32,6.35 180 bottom
C26  2.79,6.6 0 bottom
C27  32.51,11.18 90 bottom
CHG  22.1,2.54 180 bottom
D1  27.69,7.87 180 bottom
D2  8.89,68.07 180 bottom
D3  8.89,65.53 180 bottom
D4  8.13,59.94 180 bottom
D5  17.27,2.95 270 bottom
ENABLE_SWITCH  1.78,21.08 90 bottom
FB1  4.83,46.74 180 bottom
FID1  38.1,74.93 90 bottom
FID2  12.7,74.93 270 bottom
FID3  38.1,3.3 90 bottom
FID4  12.7,3.3 270 bottom
FUL  20.07,2.54 180 bottom
GOLD_ORB_SM1  49.02,61.72 90 bottom
I2C_PORT  30.61,71.07 180 bottom
J2  27.43,1.46 0 bottom
JP1  2.16,57.4 90 bottom
JP2  2.16,49.78 90 bottom
JP3  52.32,50.55 270 bottom
L2  6.86,55.37 90 bottom
LED  33.27,2.54 180 bottom
MICROSD  49.28,15.75 0 bottom
NEOPIXEL  7.87,75.06 0 bottom
Q1  29.72,11.18 0 bottom
Q2  8.89,70.87 270 bottom
R1  14.73,13.97 180 bottom
R2  29.72,14.48 0 bottom
R3  7.62,22.61 270 bottom
R4  9.4,18.8 90 bottom
R5  21.08,7.62 180 bottom
R6  21.08,5.56 180 bottom
R7  2.79,41.66 90 bottom
R8  7.37,15.49 0 bottom
R9  7.37,12.7 180 bottom
R10  12.7,26.92 180 bottom
R11  34.04,6.6 90 bottom
R12  11.18,62.74 270 bottom
R13  32.51,67.82 0 bottom
R14  28.57,67.82 180 bottom
R15  17.27,7.62 90 bottom
R16  31.75,7.11 270 bottom
SENSE  53.09,61.72 0 bottom
SJ1  45.09,55.12 270 bottom
TP1  52.96,35.81 270 bottom
TP2  52.96,33.27 270 bottom
TP3  52.96,30.73 270 bottom
TP4  52.96,28.19 270 bottom
TP5  52.96,25.65 270 bottom
U1  21.59,11.18 0 bottom
U2  10.92,22.61 270 bottom
U3  14.73,40.89 270 bottom
U4  3.56,29.97 0 bottom
U$1  2.29,73.91 90 bottom
U$4  2.29,2.29 90 bottom
U$5  52.58,73.91 90 bottom
U$7  52.58,2.29 90 bottom
U$31  50.04,74.68 270 top
U$37  [OSO_WORDMARK_THREELINE_450MIL_1000DPI]  18.67,68.33 0 bottom
U$44  [OSO_BEAR_250X360MIL_1000DPI]  39.88,68.83 0 bottom
X1  19.81,19.86 0 bottom

### Tracks (layer width: path | path; a pad name or v marks a point on that pad's centre or on a via)
!RESET  (via drill 0.25)
  Top 0.152: v36.58,26.16 21.59,26.16 19.81,27.94 v12.7,27.94 12.7,24.13 9.91,24.13 6.85,21.08 v6.85,17.52 | v9.14,39.62 5.56,39.62 v3.53,37.59
  Bottom 0.152: v12.7,27.94 12.42,27.94 3.53,36.83 v3.53,37.59 | v9.14,39.62 U3.40 | v36.58,26.16 44.32,26.16 44.83,25.65 TP5.P$1 | R9.2 8.32,12.8 R8.1 | C13.2 10.19,15.49 R8.1 | R8.1 8.32,16 6.85,17.46 v6.85,17.52
+3V3  (via drill 0.3)
  Top 0.305: v6.35,29.46 v10.16,25.65 | v24.38,47.75 v19.76,47.75 | v32.35,50.29 v32.35,53.26 | v2.54,43.94 2.54,47.24 v3.3,48.01 | v10.67,37.41 11.18,37.92 11.18,40.89 v10.41,41.66 13.26,44.5 20.59,44.5 v20.64,44.45 22.16,42.93 27.43,42.93 v32.26,47.75 36.07,43.94 v44.87,43.94 46.48,43.94 47.24,43.18 47.24,33.78 v50.29,30.73 50.29,19.59 v44.17,13.46 43.91,13.72 v22.86,13.72 | v17.27,11.68 v14.48,11.68 | v32.77,65.79 v27.18,65.79
  Bottom 0.305: C17.2 19.91,50.99 19.32,51.58 | 16.76,56.9 13.67,56.9 10.35,53.57 L2.P$1 | 16.76,56.9 17.02,56.9 17.36,56.55 U$31.15 17.36,53.55 | 17.36,53.55 16.86,54.05 U$31.16 16.86,56.8 16.76,56.9 | 17.36,53.55 19.32,51.58 | 19.32,51.58 19.32,48.07 | v32.35,50.29 32.35,47.85 v32.26,47.75 30.86,47.75 | v24.38,47.75 30.86,47.75 | U4.8 6.35,31.68 v6.35,29.46 | v10.16,25.65 10.16,26.2 C14.1 | NEOPIXEL.2 7.42,73.35 7.87,72.9 15.49,72.9 24.89,63.5 | 24.89,63.5 v24.89,60.2 26.42,60.2 30.83,55.79 30.83,54.79 v32.35,53.26 35.6,56.52 SJ1.1 | FB1.1 5.21,48.07 | 19.32,48.07 5.21,48.07 | C12.2 7.86,37.64 10.44,37.64 v10.67,37.41 U3.36 | U3.44 v10.41,41.66 8.64,41.66 7.91,42.38 C10.2 | U3.17 19.88,41.66 C8.2 20.64,43.94 v20.64,44.45 20.64,44.96 C7.2 | 19.32,48.07 19.43,48.07 19.75,47.75 v19.76,47.75 | 5.21,48.07 3.37,48.07 v3.3,48.01 2.16,49.15 JP2.1 | U$31.28 v44.86,43.93 v44.87,43.94 | R7.2 2.54,42.86 v2.54,43.94 | C25.1 50.8,6.35 47.5,3.05 44.7,3.05 43.58,4.18 MICROSD.4 43.58,5.73 44.17,6.32 v44.17,13.46 | 8.64,10.41 7.37,11.68 7.37,13.53 6.42,14.48 R8.2 5.4,16.51 4.32,16.51 2.81,18.02 2.81,24.38 4.08,25.65 v10.16,25.65 | 8.64,10.41 10.41,8.64 ACCESSORY_PORT.2 10.41,5.08 9.65,4.32 6.35,4.32 4.06,6.6 C26.1 | v10.16,25.65 12.38,25.65 R10.2 | v14.48,11.68 9.91,11.68 8.64,10.41 | C3.1 16.83,12.13 v17.27,11.68 17.71,12.13 C2.1 19.37,12.13 20.07,11.43 20.95,11.43 22,12.48 U1.5 22.54,13.4 v22.86,13.72 | v50.29,30.73 TP3.P$1 | C4.1 C5.1 30.92,47.81 30.86,47.75 | I2C_PORT.2 30.11,70.24 27.69,67.82 R14.1 27.62,66.23 v27.18,65.79 24.89,63.5 | R13.1 33.46,66.48 v32.77,65.79
_ACCESSORY
  Bottom 0.152: ACCESSORY_PORT.3 13.08,6.6 R15.1
A0_AUDIO  (via drill 0.25)
  Top 0.152: v46.48,46.23 35.81,46.23 33.27,48.77 30.4,48.77 27.94,46.3 16.79,46.3 16.33,45.85 13.06,45.85 12.7,45.49 v12.7,45.24
  Bottom 0.152: JP3.9 46.8,46.55 v46.48,46.23 | U3.3 12.95,44.98 v12.7,45.24
A2_HINGE_SENSOR  (via drill 0.25)
  Top 0.152: v16.09,46.4 16.09,55.71 22.1,61.72 v35.31,61.72
  Bottom 0.152: U3.9 16,46.31 v16.09,46.4 | SENSE.1 v35.31,61.72
A4_VBATMON  (via drill 0.25)
  Top 0.152: v16.98,45.79 17.17,45.79 17.38,46 17.8,46 17.98,45.82 21.18,45.82 22.3,44.7 v26.92,44.7 | v28.45,27.94 29.21,27.94 30.2,28.93 30.2,42.11 v29.3,43.01
  Bottom 0.152: R4.2 R4.1 10.62,18.21 11.63,19.23 11.63,19.41 15.59,23.37 21.34,23.37 22.61,24.64 22.61,26.42 24.38,28.19 28.19,28.19 v28.45,27.94 | v16.98,45.79 16.95,45.76 17.02,45.7 U3.11 | v29.3,43.01 27.61,44.7 v26.92,44.7
A5_VBUSMON  (via drill 0.25)
  Top 0.152: v26.42,44.22 22.35,44.22 21.05,45.52 v17.58,45.52 | v27.43,28.7 27.71,28.42 28.85,28.42 29.72,29.29 29.72,41.91 v29.46,42.16
  Bottom 0.152: R4.4 R4.3 8.99,18.12 9.48,18.61 10.58,18.61 11.33,19.35 11.33,19.56 15.64,23.88 21.08,23.88 22.23,25.02 22.23,27.05 23.88,28.7 v27.43,28.7 | U3.12 17.58,44.43 v17.58,45.52 | v26.42,44.22 27.41,44.22 v29.46,42.16
AVCC
  Bottom 0.152: U3.6 14.48,44.96 13.72,45.72 12.95,45.72 | FB1.2 C9.2 7.69,46.67 8.64,45.72 12.95,45.72 | 12.95,45.72 13.46,45.21 U3.4
D0_SERCOM1_RX
  Bottom 0.152: U3.2 12.45,44.78 12.06,45.16 8.76,45.16 8.43,45.49 3.02,45.49 1.17,47.35 1.17,52.22 3.3,54.36 3.3,58.8 JP1.3
D1_SERCOM1_TX
  Bottom 0.152: U3.1 11.94,44.63 11.71,44.86 2.64,44.86 0.76,46.74 0.76,53.47 JP1.1
D2_A3_ACCESSORY  (via drill 0.25)
  Top 0.152: v16.51,45.21 17.2,45.21 17.38,45.03 17.78,45.03 17.96,45.21 20.83,45.21 22.61,43.43 26.11,43.43 v26.16,43.48 | v24.64,27.69 26.67,29.72 v26.67,41.66
  Bottom 0.152: D5.C 18.29,5.81 18.29,7.62 R15.2 17.75,9.12 19.25,9.12 19.43,8.94 21.14,8.94 21.19,8.89 23.11,8.89 23.37,9.14 23.37,17.78 24.64,19.05 v24.64,27.69 | U3.10 v16.51,45.21 | v26.16,43.48 26.7,42.95 26.67,42.93 v26.67,41.66
D3_LOCK_BUTTON  (via drill 0.25)
  Top 0.152: v3.81,67.06 10.16,60.71 v10.16,43.18
  Bottom 0.152: BTN_LOCK.P$2 2.23,68.63 v3.81,67.06 | v10.16,43.18 U3.47
D4_TOUCHINT  (via drill 0.25)
  Top 0.152: v30.73,39.88 30.73,40.64 33.02,42.93 v45.72,42.93
  Bottom 0.152: U3.23 20.07,38.61 21.34,39.88 v30.73,39.88 | v45.72,42.93 45.86,42.79 U$31.26
D5_SWDIO_USBID  (via drill 0.25)
  Top 0.152: v36.58,27.18 v26.16,27.18 22.1,27.18 19.81,29.46 v12.19,29.46 | v4.8,42.93 8.89,42.93 v9.03,42.78
  Bottom 0.152: v12.19,29.46 11.76,29.46 4.39,36.83 4.39,41.56 4.85,42.02 4.85,42.67 4.8,42.72 v4.8,42.93 | v9.03,42.78 9.14,42.67 9.17,42.67 9.2,42.7 11.12,42.7 11.15,42.67 U3.46 | v26.16,27.18 26.16,19.3 23.88,17.02 23.88,6.22 24.95,5.15 26.4,5.15 26.78,4.77 J2.4 | TP1.P$1 44.32,27.18 v36.58,27.18
D6_SDCS  (via drill 0.25)
  Top 0.152: v24.39,29.46 23.24,30.61 v23.24,34.67
  Bottom 0.152: U3.24 19.81,38.1 v23.24,34.67 | v24.39,29.46 29.24,29.46 42.68,16.02 42.68,7.57 41.38,6.27 MICROSD.2
D7_SDCD  (via drill 0.25)
  Top 0.152: v31.24,40.39 47.24,24.38 v47.24,19.56
  Bottom 0.152: U3.22 20.14,39.12 21.64,40.62 31.01,40.62 v31.24,40.39 | MICROSD.CD1 47.24,15.34 v47.24,19.56
D8_SWCLK_NEOPIX  (via drill 0.25)
  Top 0.152: v37.08,26.67 21.84,26.67 19.81,28.7 v12.7,28.7 | v9.4,42.22 v4.37,42.22 4.32,42.27 4.32,58.7 v5.07,59.45
  Bottom 0.152: v12.7,28.7 12.09,28.7 4.01,36.78 4.01,39.64 2.95,40.71 R7.1 3.09,40.71 4.37,41.99 v4.37,42.22 | U3.45 9.45,42.16 v9.4,42.22 | v5.07,59.45 5.07,72.8 NEOPIXEL.1 | TP4.P$1 51.44,26.67 v37.08,26.67
D9_EINK_CS  (via drill 0.25)
  Top 0.152: v15.75,32.72 17.65,32.72 25.15,40.21 v25.15,41.15 | v19.81,52.32 19.81,52.6 21.16,53.95 25.09,53.95 25.14,53.9 25.35,53.9 v25.37,53.92
  Bottom 0.152: v15.75,32.72 15.57,32.89 15.55,32.89 13.97,34.47 U3.32 | v25.37,53.92 25.7,53.59 31.09,53.59 34.39,50.29 34.39,48.26 31.5,45.36 25.4,45.36 25.15,45.11 v25.15,41.15 | U$31.12 18.86,53.28 v19.81,52.32
D10_EINK_DC  (via drill 0.25)
  Top 0.152: v16.15,33.38 17.88,33.38 24.38,39.88 v24.38,41.15 | v20.47,52.32 20.47,52.6 21.36,53.49 24.87,53.49 v24.89,53.47
  Bottom 0.152: v20.47,52.32 20.47,52.35 19.36,53.46 U$31.11 | v16.15,33.38 15.73,33.38 14.48,34.62 U3.31 | v24.89,53.47 25.07,53.29 30.96,53.29 34.09,50.16 34.09,48.39 31.37,45.67 25.27,45.67 24.84,45.23 24.84,41.73 24.38,41.27 v24.38,41.15
D11_EINK_RST  (via drill 0.25)
  Top 0.152: v15.75,34.04 18.11,34.04 23.62,39.55 v23.62,41.15 | v21.13,52.32 21.79,52.98 v24.44,52.98
  Bottom 0.152: v21.13,52.32 21.13,52.37 19.86,53.65 U$31.10 | U3.30 14.99,34.8 v15.75,34.04 | v24.44,52.98 30.84,52.98 33.78,50.04 33.78,48.51 31.24,45.97 25.15,45.97 24.53,45.36 24.53,42.13 23.62,41.22 v23.62,41.15
D12_EINK_BUSY
  Bottom 0.152: U3.21 20.19,39.62 22.45,41.88 22.45,46.89 22.1,47.24 22.1,52.16 20.36,53.9 U$31.9
D13_LED  (via drill 0.25)
  Top 0.152: v21.08,24.64 26.16,24.64 v35.05,15.75
  Bottom 0.152: U3.39 7.64,39.12 7.05,38.53 7.05,36.41 12.27,31.19 12.27,31.07 18.76,24.58 21.02,24.58 v21.08,24.64 | v35.05,15.75 35.05,6.67 R11.1
D14_TOUCH_RST
  Bottom 0.152: U$31.27 45.36,40.21 37.61,32.46 18.92,32.46 15.49,35.89 U3.29
D15_SERCOM3_MOSI  (via drill 0.25)
  Top 0.152: v18.73,57.15 18.92,57.34 34.86,57.34 41.66,50.55 v45.72,50.55
  Bottom 0.152: U3.28 16,35.81 19.05,32.77 27.69,32.77 45.47,50.55 v45.72,50.55 JP3.5 | U$31.14 17.86,56.26 18.73,57.13 v18.73,57.15
D16_9PIN_CS
  Bottom 0.152: U3.27 16.51,35.74 19.18,33.07 27.13,33.07 45.6,51.55 JP3.4
D17_9PIN_DC_SERCOM3_MISO
  Bottom 0.152: U3.26 17.02,35.66 19.3,33.38 26.57,33.38 45.74,52.55 JP3.3
D18_SERCOM3_SCK  (via drill 0.25)
  Top 0.152: v46.61,49.53 v41.63,49.53 v41.62,49.54 34.52,56.64 19.68,56.64 v19.43,56.39
  Bottom 0.152: U3.25 17.53,35.59 19.43,33.68 25.76,33.68 v41.62,49.54 | v46.61,49.53 46.75,49.53 46.76,49.55 JP3.6 | U$31.13 18.36,55.44 19.3,56.39 v19.43,56.39
D25_SERCOM4_SDA  (via drill 0.25)
  Top 0.152: v18.98,47.47 19.21,47.24 24.97,47.24 32.78,55.05 32.78,56.11 | v31.76,56.15 31.76,56.11 32.78,56.11 | 32.78,56.11 33.85,56.11 41.42,48.54 v45.67,48.54
  Bottom 0.152: U3.7 14.99,46.74 15.72,47.47 v18.98,47.47 | I2C_PORT.3 31.11,69.98 29.52,68.4 R14.2 29.52,58.39 v31.76,56.15 | JP3.7 v45.68,48.55 v45.67,48.54 43.86,46.73 U$31.30
D26_SERCOM4_SCL  (via drill 0.25)
  Top 0.152: v18.29,46.99 18.34,46.94 25.09,46.94 33.27,55.12 v33.27,55.63 41.35,47.55 v46.2,47.55
  Bottom 0.152: U3.8 15.49,46.48 16,46.99 v18.29,46.99 | I2C_PORT.4 32.11,68.98 31.56,68.44 R13.2 31.56,58.05 33.26,56.35 v33.26,55.64 v33.27,55.63 | JP3.8 v46.2,47.55 44.36,45.7 U$31.29
D27_SERCOM5_MISO  (via drill 0.25)
  Top 0.152: v9.82,38.27 9.82,37.17 10.62,36.37 17.12,36.37 v18.19,37.44 | v21.34,35.31 23.64,35.31 26.05,32.9 v26.05,31.63
  Bottom 0.152: U3.37 9.99,38.1 v9.82,38.27 | v18.19,37.44 19.2,37.44 v21.34,35.31 | MICROSD.7 46.88,6.11 45.72,7.26 45.72,15.75 29.84,31.63 v26.05,31.63
D28_SERCOM5_MOSI  (via drill 0.25)
  Top 0.152: v10.41,38.61 10.16,38.86 v5.84,38.86 | v20.32,30.23 v11.68,30.23
  Bottom 0.152: U3.38 v10.41,38.61 | v11.68,30.23 11.43,30.23 4.7,36.96 4.7,38.41 5.15,38.86 v5.84,38.86 | v20.32,30.23 20.37,30.28 29.34,30.28 43.62,15.99 43.62,7.01 42.48,5.87 MICROSD.3
D29_SERCOM5_SCK  (via drill 0.25)
  Top 0.152: v20.32,30.99 20.17,31.14 v11.2,31.14
  Bottom 0.152: v20.32,30.99 29.56,30.99 44.68,15.88 MICROSD.5 | v11.2,31.14 10.94,31.14 6.67,35.41 6.67,43.11 7.25,43.69 U3.48
D30_QSPI_SCK  (via drill 0.25)
  Top 0.152: v19.46,40.62 19.53,40.54 19.53,38.1 17.5,36.07 7.5,36.07 6.53,35.1 3.35,35.1 v3.05,34.8
  Bottom 0.152: v19.46,40.62 19.43,40.64 U3.19 | v3.05,34.8 2.92,34.67 U4.6
D31_QSPI_CS  (via drill 0.25)
  Top 0.152: v20.02,40.23 20.02,38.15 17.63,35.76 7.62,35.76 6.66,34.8 3.81,34.8 1.52,32.51 v1.52,30.48
  Bottom 0.152: U3.20 19.91,40.13 v20.02,40.23 | v1.52,30.48 3.81,30.48 5.46,28.83 5.46,28.19 | 5.46,28.19 U4.1 | R10.1 10.48,28.19 5.46,28.19
D32_QSPI_DATA[0]  (via drill 0.25)
  Top 0.152: v19.56,43.92 20.09,43.92 21.41,42.6 21.41,37.8 18.16,34.54 8.38,34.54 v4.83,30.99
  Bottom 0.152: U3.13 19.33,43.69 v19.56,43.92 | v4.83,30.99 1.78,30.99 1.65,31.11 U4.5
D33_QSPI_DATA[1]  (via drill 0.25)
  Top 0.152: v19.96,43.36 21.11,42.22 21.11,37.93 18.02,34.85 8,34.85 4.09,30.93 4.09,29.23 v4.06,29.21
  Bottom 0.152: U3.14 19.08,43.18 19.26,43.36 v19.96,43.36 | v4.06,29.21 4.06,27.94 4.19,27.81 U4.2
D34_QSPI_DATA[2]  (via drill 0.25)
  Top 0.152: v19.56,42.82 19.89,42.82 20.8,41.91 20.8,38.07 17.89,35.15 7.87,35.15 2.92,30.2 v2.92,29.16
  Bottom 0.152: U3.15 19.04,42.67 19.2,42.82 v19.56,42.82 | v2.92,29.16 U4.3
D35_QSPI_DATA[3]  (via drill 0.25)
  Top 0.152: v19.3,42.22 19.81,42.22 20.5,41.53 20.5,38.2 17.75,35.46 7.75,35.46 6.77,34.48 4.67,34.48 v4.31,34.12
  Bottom 0.152: v19.3,42.22 19.25,42.16 U3.16 | v4.31,34.12 4.19,34 U4.7
EN
  Bottom 0.152: ENABLE_SWITCH.2 5.47,21.08 6.77,19.79 6.77,18.29 7.87,17.18 10.76,17.18 13.78,14.16 R1.1 13.78,13.72 15.02,12.47 15.02,11.39 15.34,11.07 19.39,11.07 20.59,9.88 U1.3
GDR
  Bottom 0.152: Q2.1 13.02,71.82 23.86,60.98 U$31.2
GND  (via drill 0.25)
  other vias: 45.72,6.35 16.83,42.99 15.43,42.99 12.64,42.99 12.64,41.59 12.64,38.8 16.83,38.8 15.43,41.59 19.99,41.05 21.89,42.01 23.11,41.78 11.43,46.74 14.22,52.32 2.54,51.82 17.65,52.27 22.61,52.17 22.61,60.55 11.68,53.85 8.13,55.37 7.87,18.8 5.33,17.27 14.73,16 8.64,11.43 9.65,20.83 21.08,29.46 35.94,34.16 39.12,36.83 48.01,51.05 48.01,52.04 39.88,54.36 35.05,50.8 24.38,51.31 20.83,50.04 22.1,14.73 25.4,14.73 29.97,16 27.69,11.18 21.97,11.56 19.94,9.53 17.27,10.29 5.59,41.4 6.02,36.32 9.14,36.83 9.4,40.64 44.17,14.99 9.55,33.22 50.55,31.8 49.73,29.46 14.03,41.59 14.03,40.2 15.43,40.2 14.03,38.8 15.43,38.8 12.64,40.2 16.83,40.2 16.83,41.59 14.03,42.99
  pour Bottom (rank 6): 55.37,0 55.37,76.2 0,76.2 0,0
  pour Top: 54.86,-0.02 54.86,76.2 -0.49,76.2 -0.49,-0.02
N$1
  Bottom 0.152: R9.1 6.32,12.81 4.27,14.86 BTN_RESET.P$2
N$2
  Bottom 0.152: D2.A 8.2,65.53 D3.C 7.18,65.39 C24.2
N$3  (via drill 0.25)
  Top 0.152: v9.91,64.01 7.62,66.29 v7.62,69.85
  Bottom 0.152: v9.91,64.01 9.08,63.18 C24.1 9.08,60.84 D4.A 9.98,59.13 8.02,57.17 L2.P$2 | Q2.3 7.62,70.7 v7.62,69.85
N$4
  Bottom 0.152: R6.1 20.13,5.05 20.89,4.29 20.89,2.69 CHG.C
N$5
  Bottom 0.305: JP3.1 48.58,54.55 48.01,55.12 SJ1.2 45.09,53.72
N$7
  Bottom 0.152: LED.A 33.02,3.84 33.02,6.54 R11.2
N$9
  Bottom 0.152: FUL.A 20.07,3.94 19.28,4.72 19.28,6.77 R5.1
PREVGH
  Bottom 0.152: D4.C 6.24,59.94 5.22,58.92 4.96,58.92 3.85,57.8 3.85,50.27 4.29,49.84 10.94,49.84 12.19,51.09 C20.1 12.95,52.32 14.36,53.73 U$31.21
PREVGL
  Bottom 0.152: C22.1 | C22.1 8.49,51.02 9.49,52.01 11.63,52.01 13.36,53.74 U$31.23 | D3.A 9.93,65.53 8.23,63.84 8.23,59.03 7.82,58.62 5.12,58.62 4.16,57.66 4.16,50.59 4.61,50.14 7.62,50.14 7.88,50.4 C22.1
PROG
  Bottom 0.152: R3.1 U2.5
RESE
  Bottom 0.152: Q2.2 11.92,69.92 14.61,67.22 | 14.61,67.22 23.36,58.48 U$31.3 | R12.1 14.61,67.22
SHIELD
  Bottom 0.254: J2.S2 24.23,3.46 J2.S3 | J2.S3 J2.S4 | J2.S4 30.63,3.46 J2.S1 30.63,6.94 R16.1 31.75,9.46 C27.1 | J2.S5 J2.S3 | J2.S6 J2.S4
STAT  (via drill 0.25)
  Top 0.152: v19.05,8.64 19.05,10.92 16.76,13.21 16.76,20.32 v13.72,23.37
  Bottom 0.152: R6.2 R5.2 21.02,8.64 v19.05,8.64 | U2.1 13.53,23.56 v13.72,23.37
USB_N  (via drill 0.25)
  Top 0.152: v19.05,25.91 24.89,20.07 v24.89,16.26
  Bottom 0.152: U3.33 13.46,31.37 18.92,25.91 v19.05,25.91 | v24.89,16.26 24.69,16.05 24.69,6.98 25.23,6.44 26.58,6.44 28.08,4.94 J2.2
USB_P  (via drill 0.25)
  Top 0.152: v19.22,25.06 24.38,19.89 v24.38,16.76
  Bottom 0.152: U3.34 12.95,31.32 v19.22,25.06 | J2.3 27.43,4.83 26.42,5.84 24.84,5.84 24.18,6.5 24.18,16.56 v24.38,16.76
V+  (via drill 0.3)
  Top 0.305: v28.67,28.96 28.7,28.99 v28.7,41.15 | v26.16,10.16 25.4,10.92 v22.53,10.92 19.81,10.92 v17.53,13.21
  Bottom 0.305: SJ1.3 43.05,53.72 30.48,41.15 v28.7,41.15 | v28.67,28.96 28.67,28.51 29.01,28.17 29.01,16.52 27.84,15.35 27.84,13.18 C1.1 v26.16,10.16 | U1.1 v22.53,10.92 | v26.16,10.16 28.75,10.16 Q1.2 | v26.16,10.16 26.16,8.2 D1.C | v17.53,13.21 16.76,13.97 R1.2
VBAT  (via drill 0.3)
  Top 0.305: v19.81,13.21 20.83,12.19 v28.7,12.19 | v13.21,19.94 13.21,19.95 v10.66,22.5
  Bottom 0.305: R4.6 8.99,20.98 8.72,21.25 8.72,22.06 9.16,22.5 v10.66,22.5 11.5,21.66 U2.3 | v19.81,13.21 18.81,14.21 X1.2 15.52,16.16 C6.1 v13.21,19.94 | v28.7,12.19 29.7,12.19 Q1.3
VBUS  (via drill 0.3)
  Top 0.305: v10.67,21.41 11.68,20.4 11.68,12.95 16.59,8.05 26.09,8.05 29.46,11.43 v30.67,11.43 | v28.73,6.35 25.18,2.79 v23.11,2.79
  Bottom 0.305: U2.4 10.42,21.66 v10.67,21.41 10.62,21.36 R4.8 | R2.1 v30.67,11.43 Q1.1 30.67,9.01 D1.A 28.73,7.07 v28.73,6.35 J2.1 | CHG.A 22.32,3.59 v23.11,2.79
VCOM
  Bottom 0.152: U$31.24 12.86,53.75 11.45,52.34 9.4,52.34 9.37,52.32 8.96,51.92 6.16,51.92 C23.2
VDD
  Bottom 0.152: U$31.18 15.86,53.26 C18.2
VDDCORE
  Bottom 0.152: U3.41 C11.2
VGH
  Bottom 0.152: C16.2 23.11,52.61 22.36,53.37 U$31.5
VGL
  Bottom 0.152: U$31.4 22.86,53.88 C15.2
VSH
  Bottom 0.152: U$31.20 14.86,51.72 C19.2
VSL
  Bottom 0.152: C21.2 11.13,51.09 13.86,53.81 U$31.22

### Text on the board
tPlace: RX | GND | TX | 3V | JLCJLCJLCJLC
bPlace: E-PAPER / DISPLAY | CC-BY-SA 4.0 / (except the bear!) | TINY BOOK / by joey / castillo / @josecastillo | LOCK=PB02 | On SPI1 (SERCOM3). / Pins: ECS=PA23 EDC=PA22 / ERST=PA21 EBSY=PA12 | RX | OSO-TIBO-B1-00 | HINGE=PA04 | GND | 9-PIN CON. | TX | For 2nd screen, / also on SPI1. / SECS=PA18 / SEDC=PA17 / Busy/Reset on / I2C. Last pin is / AUDIO (PA02). | BONUS! / extra de- / coupling / capacitors | 3V | 9-pin pwr / 5V<>3V | (9-PIN CONNECTOR) | D51 MCU | TOUCH SCREEN | FT6336 on main I2C. / Address should be 38h. / Interrupt TINT=PA14. / Reset TRST=PA20. | SAM | Crystal- / less. Also / note VREF / PA03 is / hard-wired to 3.3V | ALL OTHER PINS | Most blocks list their pin names for / CircuitPython as well as pad names. / I2C is SDA/SCL PB08/PB09 (on SERCOM4). / SPI is SCK/MOSI/MISO PB03/PB23/PB22 / (SERCOM5). SPI1: SCK/MOSI PA16/PA19 / (SERCOM3). NEOPIXEL (up top) is PA30. / ACCESSORY port is DAC-enabled PA05. | DEBUG / PORT | TX/RX=PA00/PA01 | SWDIO | 4MB QSPI FLASH | It's your CIRCUITPY drive!! / Under the hood, the QSPI / interface is PB10 (QSPI / SCK), PB11 (QSPI CS), and / QSPI data pins / PA08-PA11. | GND | 3V3 | BATTERY & CHARGING | Pwr monitors: BATTERY=PA06 USB=PA07. / Area between microSD & touch screen / cable is a safe spot to tape a 1.3"x1" 350mAh battery: / adafru.it/4237 | SWCLK | RESET | ACKNOWLEDGMENTS: | So many ideas & concepts from the folks @Adafruit, / especially the 9-pin second screen concept (from the MONSTER M4SK). / Lazer bear & OSO logo by Joseph Devens / @DoctorDevens. The tiny / book was designed with love in Brooklyn, New York at the workshop of / @the_prepared, and in San Antonio, Texas at my parents' kitchen table. | USB PORT & POWER SUPPLY | PA24/PA25 under the hood. USBID=PA31. | LED=PA27 | On main SPI / SDCS=PA15 / SDCD=PA13 | MICROSD